# Altium project control_board.PrjPcb
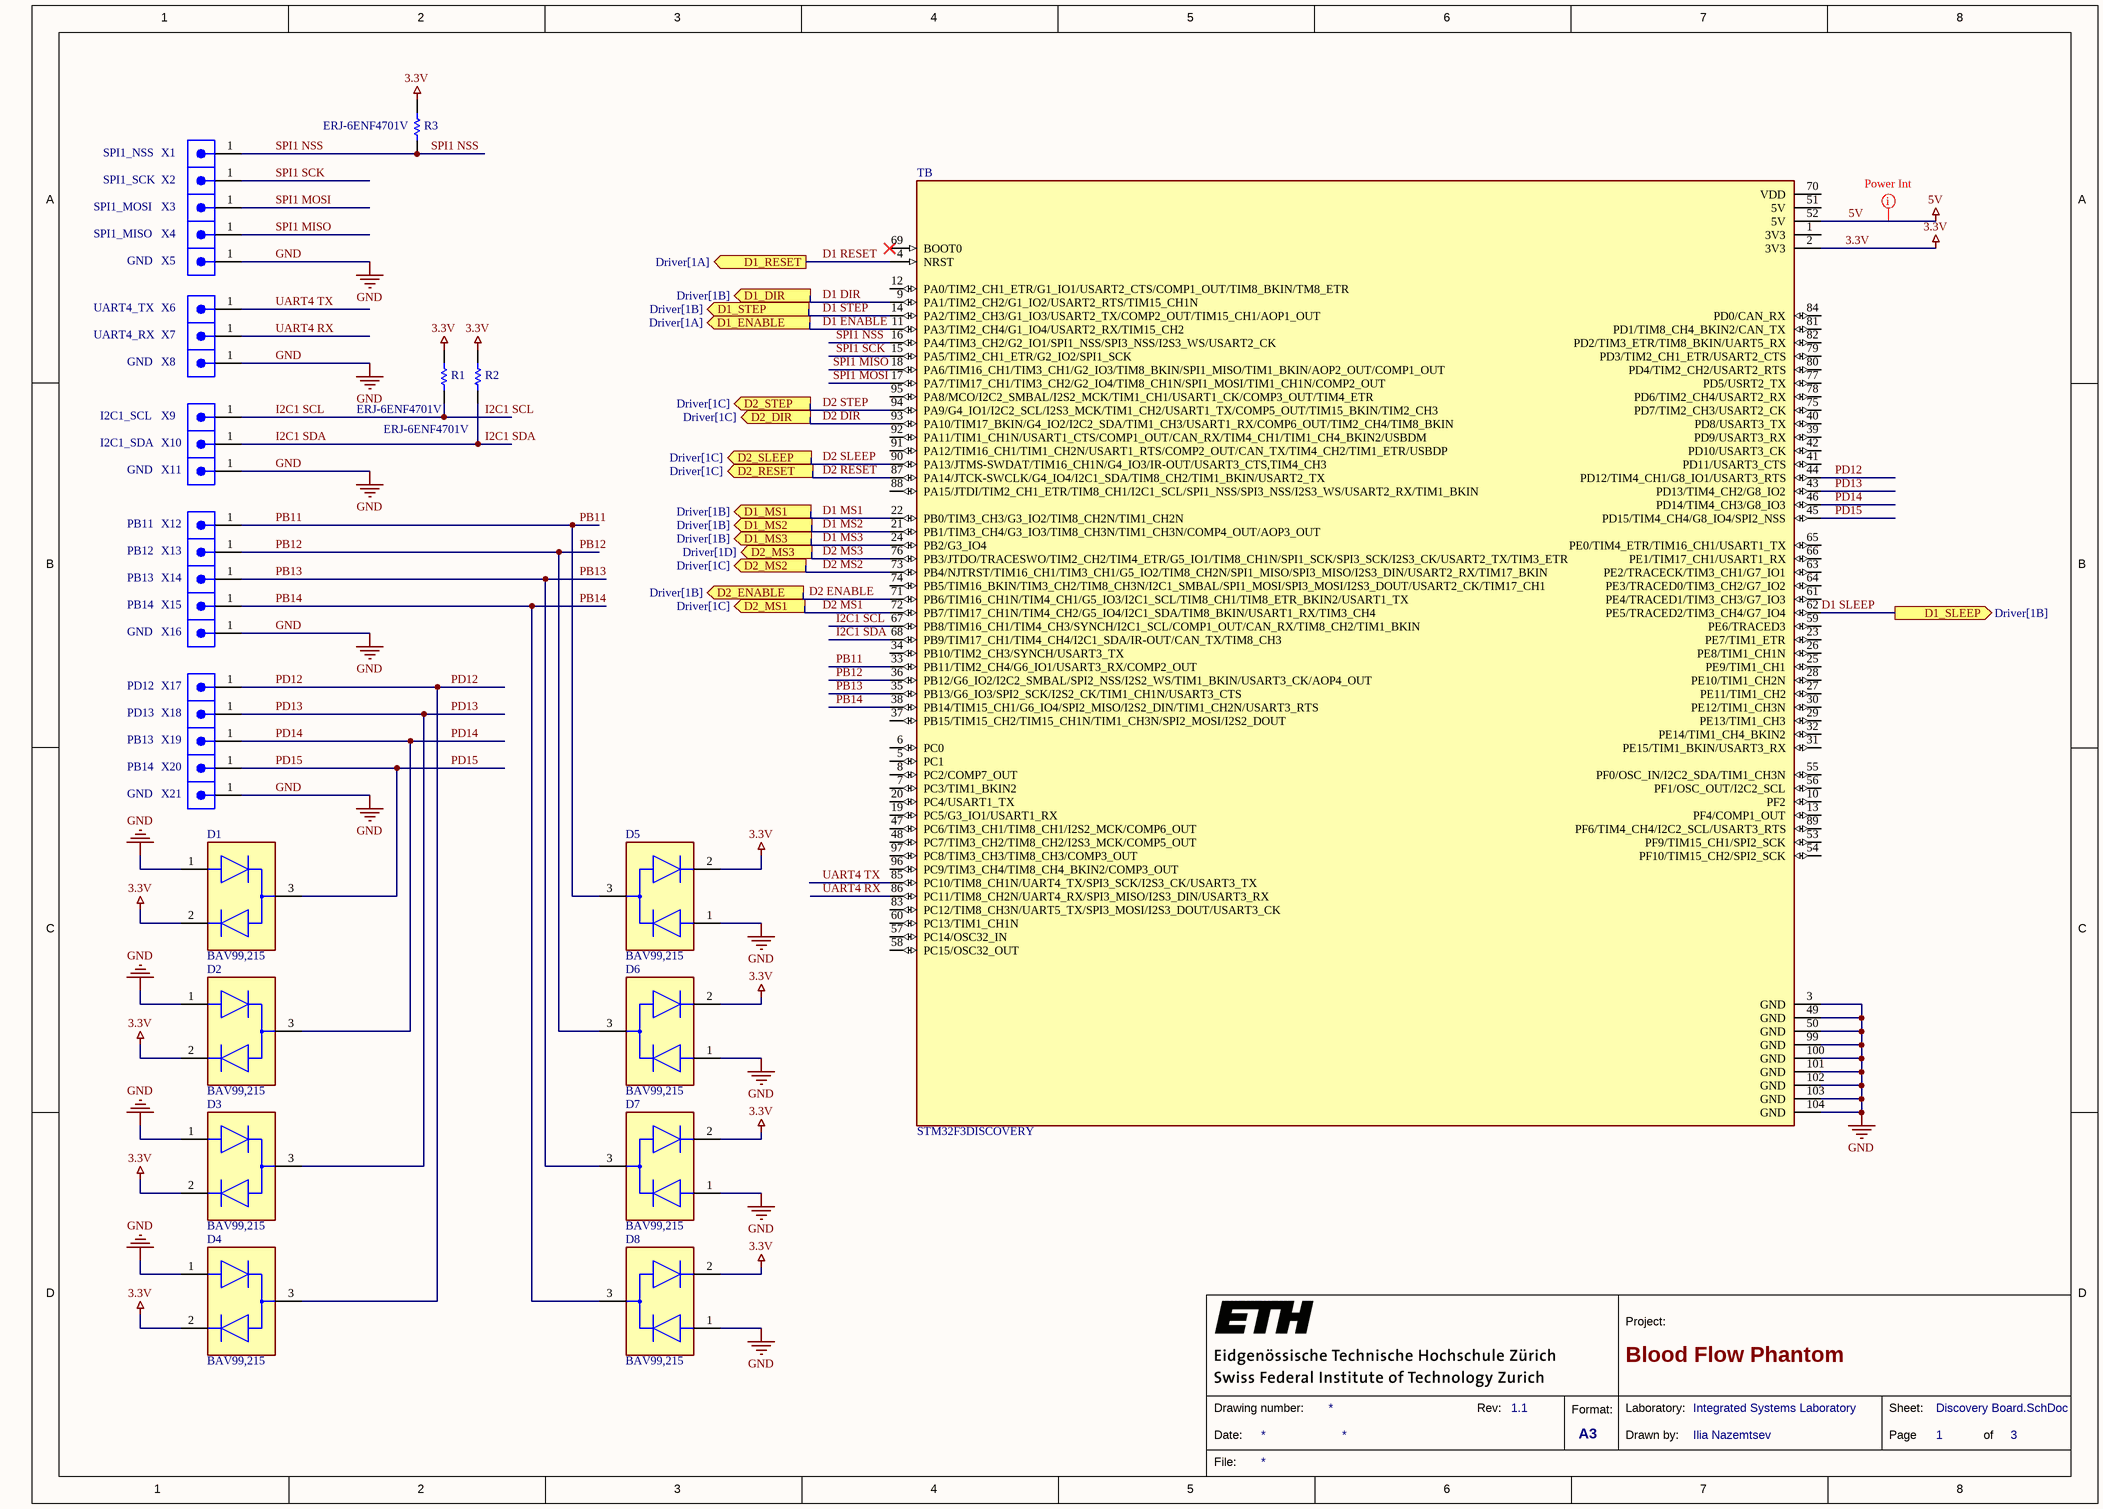
[diagram p0: Discovery Board.SchDoc]
3 sheets, 80 parts. Net scope: global (net labels, ports and power ports of the same name join across sheets).
Board file: PCB.PcbDoc
Sheets:
  Discovery Board.SchDoc
  Driver.SchDoc
  Mechanical.SchDoc

## Sheet Discovery Board.SchDoc: Blood Flow Phantom
size A3; ApprovedBy: Sergei Vostrikov; CheckedBy: Sergei Vostrikov; Author: Ilia Nazemtsev; CompanyName: ETH Zurich; DrawnBy: Ilia Nazemtsev; Organization: Integrated Systems Laboratory; Address1: Gloriastrasse 35; Address2: 8092 Zurich; Address3: ETZ J69; Revision: 1.1; SheetNumber: 1; SheetTotal: 3; Laboratory: Integrated Systems Laboratory

### Parts
D1  BAV99,215  [FP-SOT23-MFG]
D2  BAV99,215  [FP-SOT23-MFG]
D3  BAV99,215  [FP-SOT23-MFG]
D4  BAV99,215  [FP-SOT23-MFG]
D5  BAV99,215  [FP-SOT23-MFG]
D6  BAV99,215  [FP-SOT23-MFG]
D7  BAV99,215  [FP-SOT23-MFG]
D8  BAV99,215  [FP-SOT23-MFG]
R1  ERJ-6ENF4701V  [RESC2013X70X40NL20T20]
R2  ERJ-6ENF4701V  [RESC2013X70X40NL20T20]
R3  ERJ-6ENF4701V  [RESC2013X70X40NL20T20]
TB  STM32F3DISCOVERY  [SHIELD_STM32F3DISCOVERY]
X1  SPI1_NSS  [68000-101HLF]
X2  SPI1_SCK  [68000-101HLF]
X3  SPI1_MOSI  [68000-101HLF]
X4  SPI1_MISO  [68000-101HLF]
X5  GND  [68000-101HLF]
X6  UART4_TX  [68000-101HLF]
X7  UART4_RX  [68000-101HLF]
X8  GND  [68000-101HLF]
X9  I2C1_SCL  [68000-101HLF]
X10  I2C1_SDA  [68000-101HLF]
X11  GND  [68000-101HLF]
X12  PB11  [68000-101HLF]
X13  PB12  [68000-101HLF]
X14  PB13  [68000-101HLF]
X15  PB14  [68000-101HLF]
X16  GND  [68000-101HLF]
X17  PD12  [68000-101HLF]
X18  PD13  [68000-101HLF]
X19  PB13  [68000-101HLF]
X20  PB14  [68000-101HLF]
X21  GND  [68000-101HLF]

### Ports
D1_DIR (out, see Driver[1B]), D1_ENABLE (out, see Driver[1A]), D1_MS1 (out, see Driver[1B]), D1_MS2 (out, see Driver[1B]), D1_MS3 (out, see Driver[1B]), D1_RESET (out, see Driver[1A]), D1_SLEEP (out, see Driver[1B]), D1_STEP (out, see Driver[1B]), D2_DIR (out, see Driver[1C]), D2_ENABLE (out, see Driver[1B]), D2_MS1 (out, see Driver[1C]), D2_MS2 (out, see Driver[1C]), D2_MS3 (out, see Driver[1D]), D2_RESET (out, see Driver[1C]), D2_SLEEP (out, see Driver[1C]), D2_STEP (out, see Driver[1C])

### Nets
3.3V: D1.2 D2.2 D3.2 D4.2 D5.2 D6.2 D7.2 D8.2 R1.1 R2.1 R3.1 TB.2(3V3)
5V: TB.52(5V)
GND: D1.1 D2.1 D3.1 D4.1 D5.1 D6.1 D7.1 D8.1 TB.3(GND) TB.49(GND) TB.50(GND) TB.99(GND) TB.100(GND) TB.101(GND) TB.102(GND) TB.103(GND) TB.104(GND) X5.1 X8.1 X11.1 X16.1 X21.1
D1 DIR: TB.9(PA1/TIM2_CH2/G1_IO2/USART2_RTS/TIM15_CH1N) ; port D1_DIR
D1 ENABLE: TB.11(PA3/TIM2_CH4/G1_IO4/USART2_RX/TIM15_CH2) ; port D1_ENABLE
D1 MS1: TB.22(PB0/TIM3_CH3/G3_IO2/TIM8_CH2N/TIM1_CH2N) ; port D1_MS1
D1 MS2: TB.21(PB1/TIM3_CH4/G3_IO3/TIM8_CH3N/TIM1_CH3N/COMP4_OUT/AOP3_OUT) ; port D1_MS2
D1 MS3: TB.24(PB2/G3_IO4) ; port D1_MS3
D1 RESET: TB.4(NRST) ; port D1_RESET
D1 SLEEP: TB.62(PE5/TRACED2/TIM3_CH4/G7_IO4) ; port D1_SLEEP
D1 STEP: TB.14(PA2/TIM2_CH3/G1_IO3/USART2_TX/COMP2_OUT/TIM15_CH1/AOP1_OUT) ; port D1_STEP
D2 DIR: TB.93(PA10/TIM17_BKIN/G4_IO2/I2C2_SDA/TIM1_CH3/USART1_RX/COMP6_OUT/TIM2_CH4/TIM8_BKIN) ; port D2_DIR
D2 ENABLE: TB.71(PB6/TIM16_CH1N/TIM4_CH1/G5_IO3/I2C1_SCL/TIM8_CH1/TIM8_ETR_BKIN2/USART1_TX) ; port D2_ENABLE
D2 MS1: TB.72(PB7/TIM17_CH1N/TIM4_CH2/G5_IO4/I2C1_SDA/TIM8_BKIN/USART1_RX/TIM3_CH4) ; port D2_MS1
D2 MS2: TB.73(PB4/NJTRST/TIM16_CH1/TIM3_CH1/G5_IO2/TIM8_CH2N/SPI1_MISO/SPI3_MISO/I2S3_DIN/USART2_RX/TIM17_BKIN) ; port D2_MS2
D2 MS3: TB.76(PB3/JTDO/TRACESWO/TIM2_CH2/TIM4_ETR/G5_IO1/TIM8_CH1N/SPI1_SCK/SPI3_SCK/I2S3_CK/USART2_TX/TIM3_ETR) ; port D2_MS3
D2 RESET: TB.87(PA14/JTCK-SWCLK/G4_IO4/I2C1_SDA/TIM8_CH2/TIM1_BKIN/USART2_TX) ; port D2_RESET
D2 SLEEP: TB.90(PA13/JTMS-SWDAT/TIM16_CH1N/G4_IO3/IR-OUT/USART3_CTS,TIM4_CH3) ; port D2_SLEEP
D2 STEP: TB.94(PA9/G4_IO1/I2C2_SCL/I2S3_MCK/TIM1_CH2/USART1_TX/COMP5_OUT/TIM15_BKIN/TIM2_CH3) ; port D2_STEP
I2C1 SCL: R1.2 TB.67(PB8/TIM16_CH1/TIM4_CH3/SYNCH/I2C1_SCL/COMP1_OUT/CAN_RX/TIM8_CH2/TIM1_BKIN) X9.1
I2C1 SDA: R2.2 TB.68(PB9/TIM17_CH1/TIM4_CH4/I2C1_SDA/IR-OUT/CAN_TX/TIM8_CH3) X10.1
PB11: D5.3 TB.33(PB11/TIM2_CH4/G6_IO1/USART3_RX/COMP2_OUT) X12.1
PB12: D6.3 TB.36(PB12/G6_IO2/I2C2_SMBAL/SPI2_NSS/I2S2_WS/TIM1_BKIN/USART3_CK/AOP4_OUT) X13.1
PB13: D7.3 TB.35(PB13/G6_IO3/SPI2_SCK/I2S2_CK/TIM1_CH1N/USART3_CTS) X14.1
PB14: D8.3 TB.38(PB14/TIM15_CH1/G6_IO4/SPI2_MISO/I2S2_DIN/TIM1_CH2N/USART3_RTS) X15.1
PD12: D4.3 TB.44(PD12/TIM4_CH1/G8_IO1/USART3_RTS) X17.1
PD13: D3.3 TB.43(PD13/TIM4_CH2/G8_IO2) X18.1
PD14: D2.3 TB.46(PD14/TIM4_CH3/G8_IO3) X19.1
PD15: D1.3 TB.45(PD15/TIM4_CH4/G8_IO4/SPI2_NSS) X20.1
SPI1 MISO: TB.18(PA6/TIM16_CH1/TIM3_CH1/G2_IO3/TIM8_BKIN/SPI1_MISO/TIM1_BKIN/AOP2_OUT/COMP1_OUT) X4.1
SPI1 MOSI: TB.17(PA7/TIM17_CH1/TIM3_CH2/G2_IO4/TIM8_CH1N/SPI1_MOSI/TIM1_CH1N/COMP2_OUT) X3.1
SPI1 NSS: R3.2 TB.16(PA4/TIM3_CH2/G2_IO1/SPI1_NSS/SPI3_NSS/I2S3_WS/USART2_CK) X1.1
SPI1 SCK: TB.15(PA5/TIM2_CH1_ETR/G2_IO2/SPI1_SCK) X2.1
UART4 RX: TB.86(PC11/TIM8_CH2N/UART4_RX/SPI3_MISO/I2S3_DIN/USART3_RX) X7.1
UART4 TX: TB.85(PC10/TIM8_CH1N/UART4_TX/SPI3_SCK/I2S3_CK/USART3_TX) X6.1

Not connected (* = marked no-connect by the designer): TB 1(3V3) 5(PC1) 6(PC0) 7(PC3/TIM1_BKIN2) 8(PC2/COMP7_OUT) 10(PF2) 12(PA0/TIM2_CH1_ETR/G1_IO1/USART2_CTS/COMP1_OUT/TIM8_BKIN/TM8_ETR) 13(PF4/COMP1_OUT) 19(PC5/G3_IO1/USART1_RX) 20(PC4/USART1_TX) 23(PE7/TIM1_ETR) 25(PE9/TIM1_CH1) 26(PE8/TIM1_CH1N) 27(PE11/TIM1_CH2) 28(PE10/TIM1_CH2N) 29(PE13/TIM1_CH3) 30(PE12/TIM1_CH3N) 31(PE15/TIM1_BKIN/USART3_RX) 32(PE14/TIM1_CH4_BKIN2) 34(PB10/TIM2_CH3/SYNCH/USART3_TX) 37(PB15/TIM15_CH2/TIM15_CH1N/TIM1_CH3N/SPI2_MOSI/I2S2_DOUT) 39(PD9/USART3_RX) 40(PD8/USART3_TX) 41(PD11/USART3_CTS) 42(PD10/USART3_CK) 47(PC6/TIM3_CH1/TIM8_CH1/I2S2_MCK/COMP6_OUT) 48(PC7/TIM3_CH2/TIM8_CH2/I2S3_MCK/COMP5_OUT) 51(5V) 53(PF9/TIM15_CH1/SPI2_SCK) 54(PF10/TIM15_CH2/SPI2_SCK) 55(PF0/OSC_IN/I2C2_SDA/TIM1_CH3N) 56(PF1/OSC_OUT/I2C2_SCL) 57(PC14/OSC32_IN) 58(PC15/OSC32_OUT) 59(PE6/TRACED3) 60(PC13/TIM1_CH1N) 61(PE4/TRACED1/TIM3_CH3/G7_IO3) 63(PE2/TRACECK/TIM3_CH1/G7_IO1) 64(PE3/TRACED0/TIM3_CH2/G7_IO2) 65(PE0/TIM4_ETR/TIM16_CH1/USART1_TX) 66(PE1/TIM17_CH1/USART1_RX) 69(BOOT0)* 70(VDD) 74(PB5/TIM16_BKIN/TIM3_CH2/TIM8_CH3N/I2C1_SMBAL/SPI1_MOSI/SPI3_MOSI/I2S3_DOUT/USART2_CK/TIM17_CH1) 75(PD7/TIM2_CH3/USART2_CK) 77(PD5/USRT2_TX) 78(PD6/TIM2_CH4/USART2_RX) 79(PD3/TIM2_CH1_ETR/USART2_CTS) 80(PD4/TIM2_CH2/USART2_RTS) 81(PD1/TIM8_CH4_BKIN2/CAN_TX) 82(PD2/TIM3_ETR/TIM8_BKIN/UART5_RX) 83(PC12/TIM8_CH3N/UART5_TX/SPI3_MOSI/I2S3_DOUT/USART3_CK) 84(PD0/CAN_RX) 88(PA15/JTDI/TIM2_CH1_ETR/TIM8_CH1/I2C1_SCL/SPI1_NSS/SPI3_NSS/I2S3_WS/USART2_RX/TIM1_BKIN) 89(PF6/TIM4_CH4/I2C2_SCL/USART3_RTS) 91(PA12/TIM16_CH1/TIM1_CH2N/USART1_RTS/COMP2_OUT/CAN_TX/TIM4_CH2/TIM1_ETR/USBDP) 92(PA11/TIM1_CH1N/USART1_CTS/COMP1_OUT/CAN_RX/TIM4_CH1/TIM1_CH4_BKIN2/USBDM) 95(PA8/MCO/I2C2_SMBAL/I2S2_MCK/TIM1_CH1/USART1_CK/COMP3_OUT/TIM4_ETR) 96(PC9/TIM3_CH4/TIM8_CH4_BKIN2/COMP3_OUT) 97(PC8/TIM3_CH3/TIM8_CH3/COMP3_OUT)

### Layout directives
rule Width Constraint [Pref Width = 0.5mm    Min Width = 0.3mm    Max Width = 1mm]: 5V

### Notes on the sheet
- 1
- 2
- 3
- 4
- 5
- 6
- 7
- 8
- A
- B
- C
- D
- Project:
- Date:
- Drawing number:
- Rev:
- Format:
- A3
- Drawn by:
- Laboratory:
- Page
- Sheet:
- of
- File:

### Library data of the parts
D1-D8 = CMP-14399-000006-1: DIODE ARRAY GP 100V 215MA SOT23
R1-R3 = CMP-2001-00550-5: Chip Resistor, 4.7 KOhm, +/- 1%, 0.125 W, -55 to 155 degC, 0805 (2012 Metric), RoHS, Tape and Reel; Manufacturer: Panasonic; Voltage Rating: 150 V; Min Operating Temperature: -55 degC; PackageReference: 0805; Mounting Technology: Surface Mount; Height: 0.6 mm; PackageDescription: 2-Pin Surface Mount Device, Body 2 x 1.25 mm; RoHSCompliant: true; Length: 2 mm; REACH SVHC: Yes; Packaging: Tape and Reel; Pins: 2; Mount: Surface Mount; ComponentLink2Description: Datasheet; ComponentLink1URL: http://www.panasonic.com/; ComponentLink1Description: Manufacturer URL; DatasheetVersion: 04/2015; Package Quantity: 5000; ComponentLink2URL: http://industrial.panasonic.com/cdbs/www-data/pdf/RDA0000/AOA0000C86.pdf; Max Operating Temperature: 155 degC
TB = STM32F3DISCOVERY: STM32F303VCT6 Discovery STM32F3 ARMÂ® CortexÂ®-M4 MCU 32-Bit Embedded Evaluation Board; MF: STMicroelectronics; Package: LQFP-100 STMicroelectronics; MP: STM32F3DISCOVERY; Value: *; Availability: Unavailable; SnapEDA_Link: https://www.snapeda.com/parts/STM32F3DISCOVERY/STMicroelectronics/view-part/10815/?ref=snap; Price: None
X1-X21 = CMP-00008-5: 1 Positions Header, Unshrouded Connector  Through Hole Gold or Gold, GXT™; Manufacturer: Amphenol FCI; Pitch: 2.54mm; Gender: Male; Number of Positions: 1; Connector Type: Male Pin; Current Rating: 3A; Voltage Rating: 1.5kV; Insulation Resistance: 5GR; Mating Post Length: 5.84mm; Value: 1000Meg; Packaging: Bulk; Supplier: Digikey; Supplier Part Number: 609-3460-ND; ComponentLink1Description: 68000-274334-5147816.pdf; ComponentLink1URL: https://datasheet.ciiva.com/5147/68000-274334-5147816.pdf; Orientation: Straight; ComponentLink2Description: 70236886-14643004.pdf; ComponentLink3URL: https://datasheet.ciiva.com/10150/68000-10150538.pdf; ComponentLink3Description: 68000-10150538.pdf; ComponentLink2URL: https://datasheet.ciiva.com/14643/70236886-14643004.pdf; Manufacturer Part Number: 68000-101HLF; Number of Rows: 1; Termination: Solder; Contact Material: Bronze; Contact Mating Length: 0.23inch; Length: 2.54mm; Housing Material: Thermoplastic; Number of Contacts: 1; Min Operating Temperature: -65°C; Max Operating Temperature: 125°C; Package Quantity: 100; Radiation Hardening: No; ComponentLink4Description: 68000-731073.pdf; ComponentLink4URL: https://datasheet.ciiva.com/731/68000-731073.pdf; Colour: Black; Contact Plating: Nickel,Gold,GXT; Depth: 2.41mm; Flammability Rating: UL94 V-0; Voltage Rating (DC): 1.5kV; Housing Colour: Black; Max Voltage Rating (AC): 1.5kV; Contact Gender: Male; Termination Post Length: 2.41mm

## Sheet Driver.SchDoc: Blood Flow Phantom
size A4; ApprovedBy: Sergei Vostrikov; CheckedBy: Sergei Vostrikov; Author: Ilia Nazemtsev; CompanyName: ETH Zurich; DrawnBy: Ilia Nazemtsev; Organization: Integrated Systems Laboratory; Address1: Gloriastrasse 35; Address2: 8092 Zurich; Address3: ETZ J69; Revision: 1.0; SheetNumber: 2; SheetTotal: 3; Laboratory: Integrated Systems Laboratory
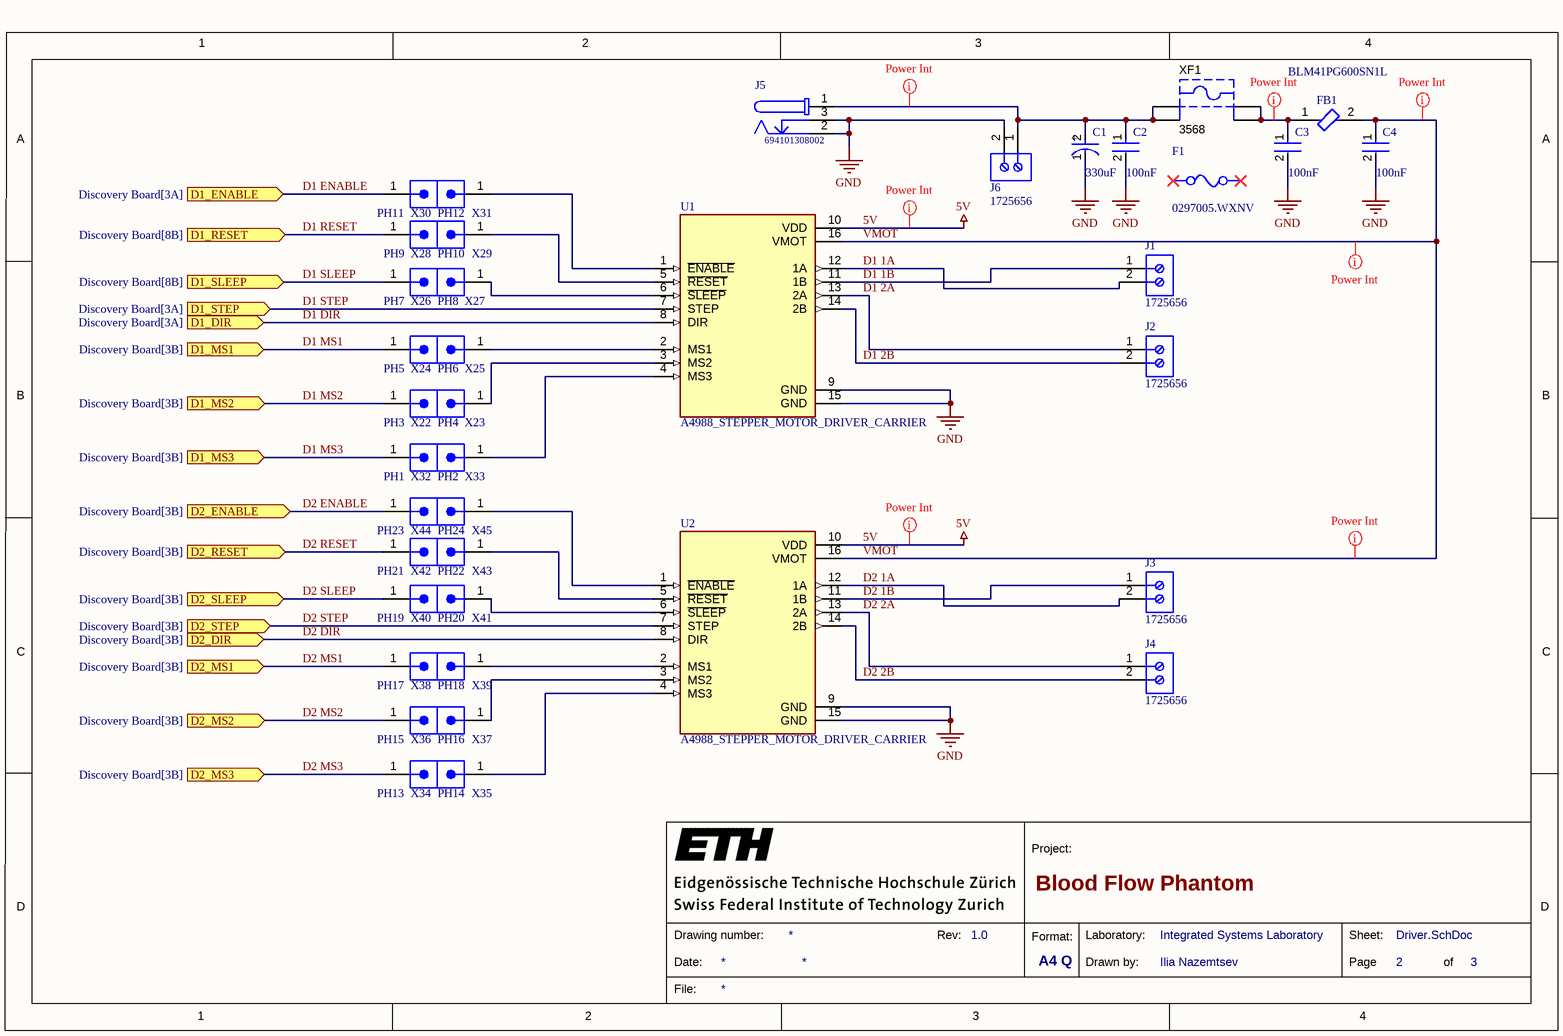
[diagram p1: Driver.SchDoc]

### Parts
C1  330uF  [FP-RAD-TH-D_10_0_5-L_12_5-MFG]
C2  100nF  [FP-CL31-IPC_C]
C3  100nF  [FP-CL31-IPC_C]
C4  100nF  [FP-CL31-IPC_C]
F1  0297005.WXNV  [FP-0297-MFG]
FB1  BLM41PG600SN1L  [FP-BLM41-0_2-IPC_B]
J1  1725656  [PHOE-1725656-2]
J2  1725656  [PHOE-1725656-2]
J3  1725656  [PHOE-1725656-2]
J4  1725656  [PHOE-1725656-2]
J5  694101308002  [694101308002]
J6  1725656  [PHOE-1725656-2]
U1  A4988_STEPPER_MOTOR_DRIVER_CARRIER  [MODULE_A4988_STEPPER_MOTOR_DRIVER_CARRIER]
U2  A4988_STEPPER_MOTOR_DRIVER_CARRIER  [MODULE_A4988_STEPPER_MOTOR_DRIVER_CARRIER]
X22  PH3  [68000-101HLF]
X23  PH4  [68000-101HLF]
X24  PH5  [68000-101HLF]
X25  PH6  [68000-101HLF]
X26  PH7  [68000-101HLF]
X27  PH8  [68000-101HLF]
X28  PH9  [68000-101HLF]
X29  PH10  [68000-101HLF]
X30  PH11  [68000-101HLF]
X31  PH12  [68000-101HLF]
X32  PH1  [68000-101HLF]
X33  PH2  [68000-101HLF]
X34  PH13  [68000-101HLF]
X35  PH14  [68000-101HLF]
X36  PH15  [68000-101HLF]
X37  PH16  [68000-101HLF]
X38  PH17  [68000-101HLF]
X39  PH18  [68000-101HLF]
X40  PH19  [68000-101HLF]
X41  PH20  [68000-101HLF]
X42  PH21  [68000-101HLF]
X43  PH22  [68000-101HLF]
X44  PH23  [68000-101HLF]
X45  PH24  [68000-101HLF]
XF1  3568  [KSTN-3568_V]

### Ports
D1_DIR (in, see Discovery Board[3A]), D1_ENABLE (in, see Discovery Board[3A]), D1_MS1 (in, see Discovery Board[3B]), D1_MS2 (in, see Discovery Board[3B]), D1_MS3 (in, see Discovery Board[3B]), D1_RESET (in, see Discovery Board[8B]), D1_SLEEP (in, see Discovery Board[8B]), D1_STEP (in, see Discovery Board[3A]), D2_DIR (in, see Discovery Board[3B]), D2_ENABLE (in, see Discovery Board[3B]), D2_MS1 (in, see Discovery Board[3B]), D2_MS2 (in, see Discovery Board[3B]), D2_MS3 (in, see Discovery Board[3B]), D2_RESET (in, see Discovery Board[3B]), D2_SLEEP (in, see Discovery Board[3B]), D2_STEP (in, see Discovery Board[3B])

### Nets
5V: U1.10(VDD) U2.10(VDD)
GND: C1.1(C) C2.2 C3.2 C4.2 J5.2 J5.3 J6.2 U1.9(GND) U1.15(GND) U2.9(GND) U2.15(GND)
D1 1A: J1.2 U1.12(1A)
D1 1B: J1.1 U1.11(1B)
D1 2A: J2.1 U1.13(2A)
D1 2B: J2.2 U1.14(2B)
D1 DIR: U1.8(DIR) ; port D1_DIR
D1 ENABLE: X30.1 ; port D1_ENABLE
D1 MS1: X24.1 ; port D1_MS1
D1 MS2: X22.1 ; port D1_MS2
D1 MS3: X32.1 ; port D1_MS3
D1 RESET: X28.1 ; port D1_RESET
D1 SLEEP: X26.1 ; port D1_SLEEP
D1 STEP: U1.7(STEP) ; port D1_STEP
D2 1A: J3.2 U2.12(1A)
D2 1B: J3.1 U2.11(1B)
D2 2A: J4.1 U2.13(2A)
D2 2B: J4.2 U2.14(2B)
D2 DIR: U2.8(DIR) ; port D2_DIR
D2 ENABLE: X44.1 ; port D2_ENABLE
D2 MS1: X38.1 ; port D2_MS1
D2 MS2: X36.1 ; port D2_MS2
D2 MS3: X34.1 ; port D2_MS3
D2 RESET: X42.1 ; port D2_RESET
D2 SLEEP: X40.1 ; port D2_SLEEP
D2 STEP: U2.7(STEP) ; port D2_STEP
VMOT: C4.1 FB1.2 U1.16(VMOT) U2.16(VMOT)
NetC1_2: C1.2(A) C2.1 J5.1 J6.1 XF1.1 XF1.2
NetC3_1: C3.1 FB1.1 XF1.3 XF1.4
NetU1_1: U1.1(~{ENABLE}) X31.1
NetU1_2: U1.2(MS1) X25.1
NetU1_3: U1.3(MS2) X23.1
NetU1_4: U1.4(MS3) X33.1
NetU1_5: U1.5(~{RESET}) X29.1
NetU1_6: U1.6(~{SLEEP}) X27.1
NetU2_1: U2.1(~{ENABLE}) X45.1
NetU2_2: U2.2(MS1) X39.1
NetU2_3: U2.3(MS2) X37.1
NetU2_4: U2.4(MS3) X35.1
NetU2_5: U2.5(~{RESET}) X43.1
NetU2_6: U2.6(~{SLEEP}) X41.1

### Layout directives
rule Width Constraint [Pref Width = 2mm    Min Width = 2mm    Max Width = 2mm]: NetC1_2, NetC3_1, VMOT
rule Width Constraint [Pref Width = 0.5mm    Min Width = 0.3mm    Max Width = 1mm]: 5V
rule Width Constraint [Pref Width = 1mm    Min Width = 1mm    Max Width = 1mm]: VMOT

### Notes on the sheet
- 1
- 2
- 3
- 4
- A
- B
- C
- Project:
- D
- Date:
- Drawing number:
- Rev:
- Format:
- A4 Q
- Drawn by:
- Laboratory:
- Page
- Sheet:
- of
- File:
- (in symbol CMP-05427-001459-1) +

### Library data of the parts
C1 = CMP-05427-001459-1: Aluminum Electrolytic Capacitors (Radial Lead Type) 330uF ±20% 35V; Lead Diameter: 0.6mm; Ripple Current (AC): 1.33A; Impedance: 43mR; Life (Hours): 6000Hour; Height: 12.5mm; Diameter: 10mm; Capacitance: 330uF; Voltage: 35V; Voltage Rating: 35V; RoHS Compliant: Yes; Series: FR Radial; REACH SVHC: No SVHC; Min Operating Temperature: -40°C; Tolerance: 20%; Termination: Radial; Ripple Current: 1.33A; Max Operating Temperature: 105°C; Lead Pitch: 5mm; Packaging: Bulk; Case/Package: Radial; Construction: RADIAL
C2-C4 = CMP-13271-001731-1: Cap Ceramic 100nF 50V X7R ±10% SMD 1206 +125°C Embossed T/R; Voltage: 50V; Thickness: 0.037inch; Lead Free: Lead Free; Length: 3.2mm; Min Operating Temperature: -55°C; Package Quantity: 15000; Packaging: Tape and Reel; Mount: Surface Mount; Depth: 1.6mm; Case/Package: 1206; Voltage Rating (DC): 50V; Tolerance: 10%; Height: 0.85mm; Capacitance: 100nF; Radiation Hardening: No; Dielectric: X7R; Voltage Rating: 50V; Max Operating Temperature: 125°C; Width: 0.063inch
F1 = CMP-08605-000073-1: FUSE AUTO 5A 32VDC BLADE MINI; Manufacturer: Littelfuse Inc; Fuse Interrupt Dc Current: 1000A; Fuse Blow Speed: Fast; Fuse Voltage Drop: 129mV; Value: 17.75mΩ; Voltage Rating: 32V; Fuse I2T: 25A2Sec; Category: Fuse; Temperature: -40°C to +125°C; Manufacturer Part Number: 0297005.WXNV; Digikey Description: FUSE AUTO 5A 32VDC BLADE MINI; Lead Free: Yes; Temperature Range High: +125°C; Package: 0297; ComponentLink2Description: Datasheet; Octopart: https://octopart.com/0297005.wxnv-littelfuse-566870; Fuse Current: 5A; Temperature Range Low: -40°C; Mouser Description: Automotive Fuses 32V 5A Mini; RoHS: TRUE; Device Class L1: Circuit Protection; Resistance: 17.75mΩ; Automotive: Yes; Device Class L2: Fuses; Device Class L3: unset; ComponentLink2URL: https://www.littelfuse.com/~/media/automotive/datasheets/fuses/passenger-car-and-commercial-vehicle/blade-fuses/littelfuse_mini_datasheet.pdf; Max Fuse Dc Voltage: 32V
FB1 = CMP-0686-00754-3: Ferrite Bead, 1806, 60Ω @ 100MHz, 0.009Ω, 6A; Manufacturer Series: BLM41P; Tolerance: 25%; Number of Lines: 1; Shielding: Unshielded; Impedance: 60R; DC Resistance-Max: 9mR; Test Frequency: 100MHz; Case Code (Imperial): 1806; Height: 1.6mm; REACH SVHC: No SVHC; Radiation Hardening: No; Core Material: Ferrite; Case Code (Metric): 4516; Frequency: 100MHz; Number of Circuits: 1; Termination: SMD/SMT; Contact Plating: Tin; Width: 1.6mm; Number of Pins: 2; Package Quantity: 1; Series: BLM41P; Max DC Current: 6A; Inductor Type: FERRITE BEAD; Case/Package: 1806; DC Current: 6A; Number of Functions: 1; Length: 4.5mm; DC Resistance (DCR): 9mR; Terminal Finish: Tin; Military Standard: Not; Min Operating Temperature: -55°C; Depth: 1.6mm; Lead Free: Lead Free; Current: 6A; RoHS Compliant: Yes; Max Current Rating: 6A; Current Rating: 6A; Max Operating Temperature: 125°C; Packaging: Tape and Reel; Material: Ferrite
J1-J4 J6 = CMP-2000-05299-1: Male Header, Pitch 2.54 mm, 1 x 2 Position, Height 9 mm, Tail Length 3.5 mm; Manufacturer: Phoenix Contact; Number of contacts: 2; Content: 250pc(s); Pitch: 2.54mm; Industrial packaging: Yes; Colour: Green; Manufacturer part No.: 1725656; Type: MPT0,5/2-2,54; Datasheet URL: http://datasheet.octopart.com/1725656-Phoenix-Contact-datasheet-5302866.pdf; Manufacturer URL: http://www.phoenixcontact.com/; Datasheet Version: Apr-08
J5 = CMP-1502-00182-1: DC Power Jack Connector Low Profile WR-DC, Male, Right Angled, THT, 2 A, 12 V; Manufacturer: Wurth Elektronik; Opening Diameter: 2.8mm; Rated Current: 2A; Plug Inner Diameter: 0.75mm; Working Voltage: 12V; Plug Outer Diameter: 2.35mm; Part Number: 694101308002; Packaging: Bag; Mounting Technology: THT; Orientation: RightAngled; Package Reference: 694101308002; Datasheet URL: http://katalog.we-online.de/em/datasheet/694101308002.pdf; Publisher: WurthElektronik; Manufacturer URL: http://www.we-online.de; Gender: Male; Operating Temperature: -40to85degC
U1 U2 = A4988_STEPPER_MOTOR_DRIVER_CARRIER: Stepper motor controler; IC: A4988; 1A; Uin mot: 8Ã·35V; Price: None; Value: *; MP: A4988_STEPPER_MOTOR_DRIVER_CARRIER; Package: None; Availability: Unavailable
X22-X45 = CMP-00008-5: as X1 on sheet Discovery Board; Packaging: Bulk; Supplier: Digikey; Supplier Part Number: 609-3460-ND; ComponentLink1Description: 68000-274334-5147816.pdf; ComponentLink1URL: https://datasheet.ciiva.com/5147/68000-274334-5147816.pdf; Orientation: Straight; ComponentLink2Description: 70236886-14643004.pdf; ComponentLink3URL: https://datasheet.ciiva.com/10150/68000-10150538.pdf; ComponentLink3Description: 68000-10150538.pdf; ComponentLink2URL: https://datasheet.ciiva.com/14643/70236886-14643004.pdf; Manufacturer Part Number: 68000-101HLF; Number of Rows: 1; Termination: Solder; Contact Material: Bronze; Contact Mating Length: 0.23inch; Length: 2.54mm; Housing Material: Thermoplastic; Number of Contacts: 1; Min Operating Temperature: -65°C; Max Operating Temperature: 125°C; Package Quantity: 100; Radiation Hardening: No; ComponentLink4Description: 68000-731073.pdf; ComponentLink4URL: https://datasheet.ciiva.com/731/68000-731073.pdf; Colour: Black; Contact Plating: Nickel,Gold,GXT; Depth: 2.41mm; Flammability Rating: UL94 V-0; Voltage Rating (DC): 1.5kV; Housing Colour: Black; Max Voltage Rating (AC): 1.5kV; Contact Gender: Male; Termination Post Length: 2.41mm
XF1 = CMP-2000-05464-1: Fuse Holder, 20 A, 500 V, -50 to 145 degC, 4-Pin THD, RoHS; Manufacturer: Keystone; Package Reference: 3568; Datasheet Version: 04/2013; Datasheet URL: https://datasheet.ciiva.com/16294/m60-2p40-16294706.pdf; Manufacturer URL: http://www.keyelco.com/; Mounting Technology: ThroughHole; Package Description: 4-Pin Through Hole Device, Body 16 x 6.73 mm, Pitch 9.9 mm

## Sheet Mechanical.SchDoc: Blood Flow Phantom
size A4; ApprovedBy: Sergei Vostrikov; CheckedBy: Sergei Vostrikov; Author: Ilia Nazemtsev; CompanyName: ETH Zurich; DrawnBy: Ilia Nazemtsev; Organization: Integrated Systems Laboratory; Address1: Gloriastrasse 35; Address2: 8092 Zurich; Address3: ETZ J69; Revision: 1.0; SheetNumber: 3; SheetTotal: 3; Laboratory: Integrated Systems Laboratory
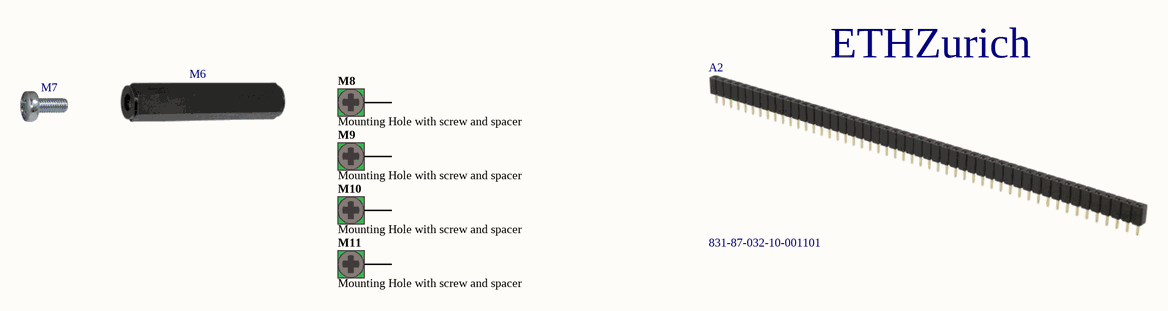
[diagram p2: Mechanical.SchDoc]

### Parts
A1  Logo ETH Zurich  [eth-zurich_5mm]  (value not drawn)  (no BOM)
A2  831-87-032-10-001101  (mechanical)
M6  Spacer M3  (value not drawn)  (mechanical)
M7  Screw M3x8  (value not drawn)  (mechanical)
M8  Mounting Hole with screw and spacer  [Hole M3 with screw]  (no BOM)
M9  Mounting Hole with screw and spacer  [Hole M3 with screw]  (no BOM)
M10  Mounting Hole with screw and spacer  [Hole M3 with screw]  (no BOM)
M11  Mounting Hole with screw and spacer  [Hole M3 with screw]  (no BOM)

### Nets

Not connected (* = marked no-connect by the designer): M8 1; M9 1; M10 1; M11 1

### Notes on the sheet
- 1
- 2
- 3
- 4
- A
- B
- C
- Project:
- D
- Date:
- Drawing number:
- Rev:
- Format:
- A4 Q
- Drawn by:
- Laboratory:
- Page
- Sheet:
- of
- File:
- (in symbol CMP-00038-1) ETHZurich

### Library data of the parts
A1 = CMP-00038-1
A2 = CMP-00706-1: Max Current Rating: 3A; Contact Resistance: 10mR; Number of Positions: 32; Max Voltage Rating (AC): 100V; Max Voltage Rating (DC): 150V; Connector Type: Socket; Gender: Female; Pitch: 2mm; Mount: Through Hole; Case/Package: SIP; Contact Plating: Gold; Contact Material: Copper; Colour: Black; Housing Colour: Black; Housing Material: Polymer; Min Operating Temperature: -55°C; Max Operating Temperature: 125°C; Number of Rows: 1; Package Quantity: 300; Packaging: Box; Termination: Solder; Number of Contacts: 32; Orientation: Straight; Length: 64mm; Depth: 2.2mm; Radiation Hardening: No
M6 = CMP-00018-1: Spacer M3 - 38mm; Form: Hexagonal - Female - Female; Size: 38mm; Material: Nylon; Color: Natural
M7 = CMP-00004-1: Screw M3x8 Pan Head Phillips; Form: Pan Head; Size: M3x8; Head Type: Phillips
M8-M11 = CMP-00214-1: Mounting Hole, 7.2mm pad, 3.2mm plated hole; ClassName: Mounting Hole

## Nets that join several sheets
5V: Discovery Board (TB.52), Driver (U1.10 U2.10)
GND: Discovery Board (22 pins), Driver (11 pins)
D1 DIR: Discovery Board (TB.9), Driver (U1.8)
D1 ENABLE: Discovery Board (TB.11), Driver (X30.1)
D1 MS1: Discovery Board (TB.22), Driver (X24.1)
D1 MS2: Discovery Board (TB.21), Driver (X22.1)
D1 MS3: Discovery Board (TB.24), Driver (X32.1)
D1 RESET: Discovery Board (TB.4), Driver (X28.1)
D1 SLEEP: Discovery Board (TB.62), Driver (X26.1)
D1 STEP: Discovery Board (TB.14), Driver (U1.7)
D2 DIR: Discovery Board (TB.93), Driver (U2.8)
D2 ENABLE: Discovery Board (TB.71), Driver (X44.1)
D2 MS1: Discovery Board (TB.72), Driver (X38.1)
D2 MS2: Discovery Board (TB.73), Driver (X36.1)
D2 MS3: Discovery Board (TB.76), Driver (X34.1)
D2 RESET: Discovery Board (TB.87), Driver (X42.1)
D2 SLEEP: Discovery Board (TB.90), Driver (X40.1)
D2 STEP: Discovery Board (TB.94), Driver (U2.7)